# Altium schematic sheet [CC2538] MCU.SchDoc
size 254 x 208 mm
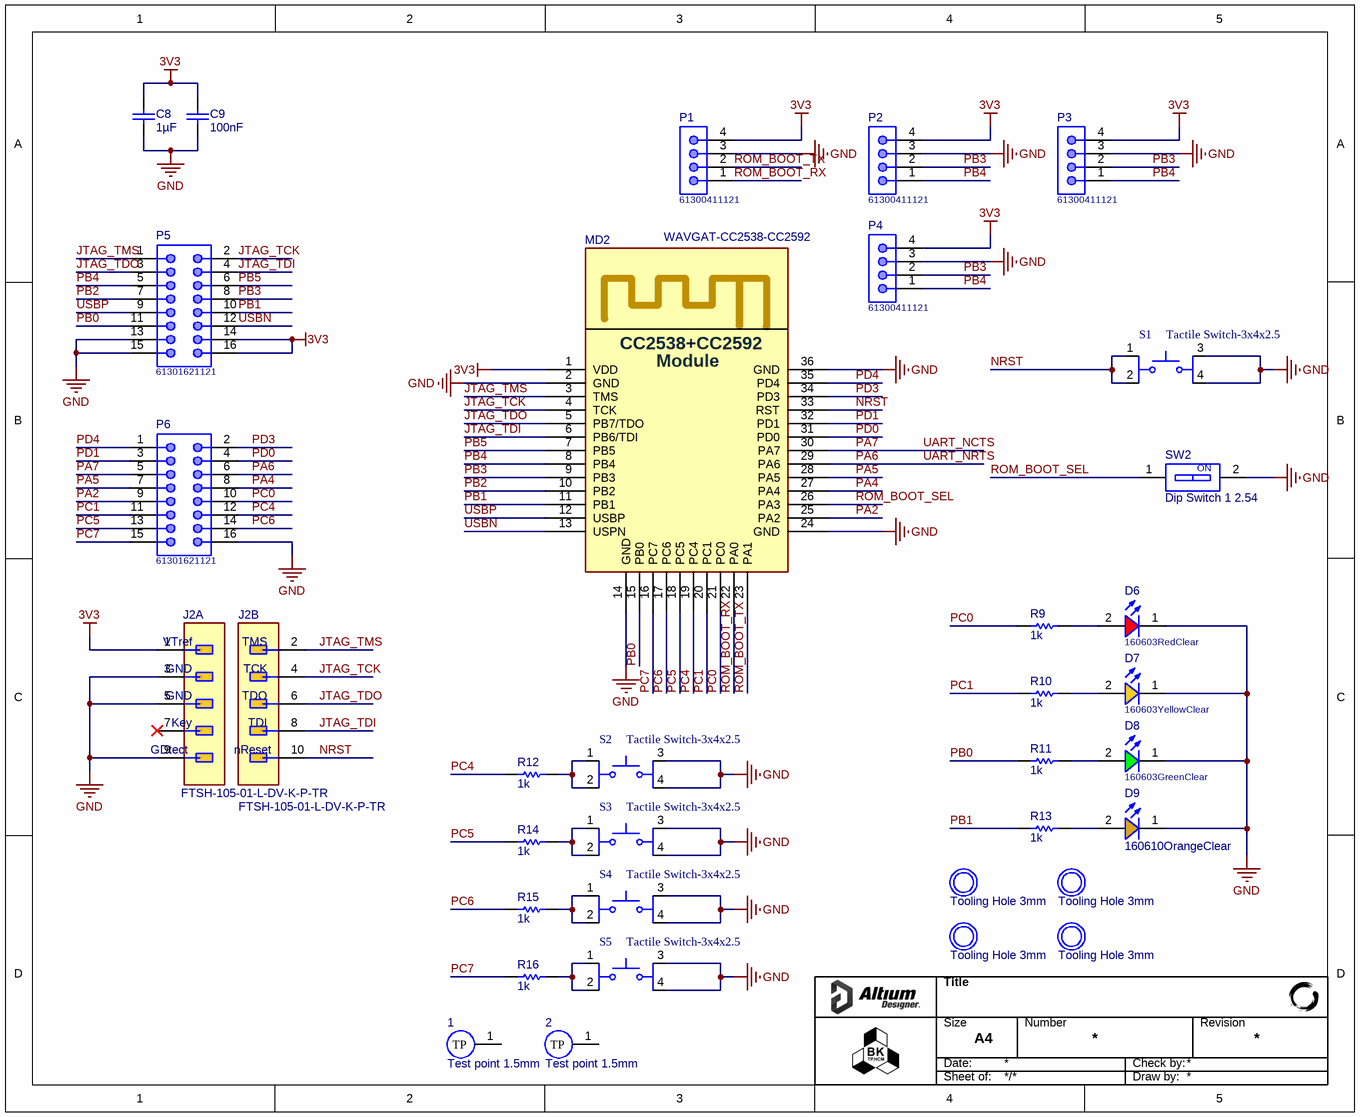
[diagram p0: [CC2538] MCU.SchDoc]

## Parts
1  Test point 1.5mm  [Test point 1.5mm-Footprint-1]
2  Test point 1.5mm  [Test point 1.5mm-Footprint-1]
C8  value 1µF  [CAP_0603]  (hidden comment: 0106031051016)
C9  value 100nF  [CAP_0603]  (hidden comment: 0106031041050)
D6  160603RedClear  [WL-SMCW_0603_H=0.7mm]
D7  160603YellowClear  [WL-SMCW_0603_H=0.7mm]
D8  160603GreenClear  [WL-SMCW_0603_H=0.7mm]
D9  160610OrangeClear  [WL-SMCW_0603_H=0.7mm]
H1  Tooling Hole 3mm  [3mm]  (no BOM)
H2  Tooling Hole 3mm  [3mm]  (no BOM)
H3  Tooling Hole 3mm  [3mm]  (no BOM)
H4  Tooling Hole 3mm  [3mm]  (no BOM)
J2  FTSH-105-01-L-DV-K-P-TR  [FP-FTSH-105-01-L-DV-K-P-T-MFG]  (parts A,B of 2)
MD2  WAVGAT-CC2538-CC2592  [WAVGAT-CC2538-CC2592-Footprint]
P1  61300411121  [61300411121]
P2  61300411121  [61300411121]
P3  61300411121  [61300411121]
P4  61300411121  [61300411121]
P5  61301621121  [61301621121]
P6  61301621121  [61301621121]
R9  value 1k  [RES_0603]  (hidden comment: 0006031021)
R10  value 1k  [RES_0603]  (hidden comment: 0006031021)
R11  value 1k  [RES_0603]  (hidden comment: 0006031021)
R12  value 1k  [RES_0603]  (hidden comment: 0006031025)
R13  value 1k  [RES_0603]  (hidden comment: 0006031021)
R14  value 1k  [RES_0603]  (hidden comment: 0006031025)
R15  value 1k  [RES_0603]  (hidden comment: 0006031025)
R16  value 1k  [RES_0603]  (hidden comment: 0006031025)
S1  Tactile Switch-3x4x2.5  [Tactile Switch-3x4x2.5 Footprint]
S2  Tactile Switch-3x4x2.5  [Tactile Switch-3x4x2.5 Footprint]
S3  Tactile Switch-3x4x2.5  [Tactile Switch-3x4x2.5 Footprint]
S4  Tactile Switch-3x4x2.5  [Tactile Switch-3x4x2.5 Footprint]
S5  Tactile Switch-3x4x2.5  [Tactile Switch-3x4x2.5 Footprint]
SW2  Dip Switch 1 2.54  [Dip Switch 1 2.54-Footprint-1]

## Nets
3V3: C8.2 C9.2 J2.1(VTref) MD2.1(VDD) P1.4 P2.4 P3.4 P4.4 P5.14 P5.16
GND: C8.1 C9.1 D6.1(K) D7.1(K) D8.1(K) D9.1(K) J2.3 J2.5 J2.9 MD2.2(GND) MD2.14(GND) MD2.24(GND) MD2.36(GND) P1.3 P2.3 P3.3 P4.3 P5.13 P5.15 P6.16 S1.3 S1.4 S2.3 S2.4 S3.3 S3.4 S4.3 S4.4 S5.3 S5.4 SW2.2
JTAG_TCK: J2.4 MD2.4(TCK) P5.2
JTAG_TDI: J2.8 MD2.6(PB6/TDI) P5.4
JTAG_TDO: J2.6 MD2.5(PB7/TDO) P5.3
JTAG_TMS: J2.2(VTref) MD2.3(TMS) P5.1
NRST: J2.10 MD2.33(RST) S1.1 S1.2
PA2: MD2.25(PA2) P6.9
PA4: MD2.27(PA4) P6.8
PA5: MD2.28(PA5) P6.7
PA6: MD2.29(PA6) P6.6  [also labelled UART_NRTS]
PA7: MD2.30(PA7) P6.5  [also labelled UART_NCTS]
PB0: MD2.15(PB0) P5.11 R11.1
PB1: MD2.11(PB1) P5.10 R13.1
PB2: MD2.10(PB2) P5.7
PB3: MD2.9(PB3) P2.2 P3.2 P4.2 P5.8
PB4: MD2.8(PB4) P2.1 P3.1 P4.1 P5.5
PB5: MD2.7(PB5) P5.6
PC0: MD2.21(PC0) P6.10 R9.1
PC1: MD2.20(PC1) P6.11 R10.1
PC4: MD2.19(PC4) P6.12 R12.1
PC5: MD2.18(PC5) P6.13 R14.1
PC6: MD2.17(PC6) P6.14 R15.1
PC7: MD2.16(PC7) P6.15 R16.1
PD0: MD2.31(PD0) P6.4
PD1: MD2.32(PD1) P6.3
PD3: MD2.34(PD3) P6.2
PD4: MD2.35(PD4) P6.1
ROM_BOOT_RX: MD2.22(PA0) P1.1
ROM_BOOT_SEL: MD2.26(PA3) SW2.1
ROM_BOOT_TX: MD2.23(PA1) P1.2
USBN: MD2.13(USPN) P5.12
USBP: MD2.12(USBP) P5.9
NetD6_2: D6.2(A) R9.2
NetD7_2: D7.2(A) R10.2
NetD8_2: D8.2(A) R11.2
NetD9_2: D9.2(A) R13.2
NetR12_2: R12.2 S2.1 S2.2
NetR14_2: R14.2 S3.1 S3.2
NetR15_2: R15.2 S4.1 S4.2
NetR16_2: R16.2 S5.1 S5.2

Not connected (* = marked no-connect by the designer): 1 1(TP); 2 1(TP); J2 7*

## Notes on the sheet
- Title
- Size
- Date:
- A4
- Number
- Check by:
- Revision
- Sheet of:
- Draw by:
- (in symbol CMP-002-00347-1, part A) GND; Key; GDtect
- (in symbol CMP-002-00347-1, part B) TMS; TCK; TDO; TDI; nReset
- (in symbol CMP-011-00016-1) ON
- (in symbol CMP-021-00009-2) CC2538+CC2592; Module

## Library data of the parts
1 2 = CMP-00028-00008-2: Test point, 1.5mm radius
C8 = CMP-001-00177-2: CAP, size 0603, 1 uF, 16 VDC, 10%; Manufacturer Part Number: CL10B105KO8NNWC; Manufacturer: Samsung Electro-Mechanics; Voltage Rating DC: 16 VDC; Component Type: Standard; Supplier 3 URL: https://www.thegioiic.com/tu-gom-0603-1uf-16v; Operating Temperature Max: + 85 C; Tolerance: 10%; Supplier 3 Part Number: N/A; Source: Capacitor_0603_10_percent.SchLib; Case/Package: 0603; Supplier 1 Part Number: 187-CL10B105KO8NNWC; Operating Temperature Min: - 40 C; Packaging: Tape and Reel; Design Item ID: 0106031051016; LCSC Part #: C1592; Supplier 2 Part Number: 1276-CL10B105KO8NNWCTR-ND; Supplier 2 URL: https://www.digikey.com/en/products/detail/samsung-electro-mechanics/cl10b105ko8nnwc/16572783; Supplier 1 URL: https://www.mouser.vn/ProductDetail/Samsung-Electro-Mechanics/CL10B105KO8NNWC?qs=81r%252BiQLm7BT%252BXtc72qn1ug%3D%3D&utm_source=mouser-refine-download&utm_medium=file&utm_campaign=CL10B105KO8NNWC&utm_content=Samsung-Electro-Mechanics; ComponentLink1URL: https://www.mouser.vn/datasheet/2/585/Samsung_MLCC_1837944-1929650.pdf; Pins: 2; Mount: SMD/SMT; ComponentLink1Description: Datasheet
C9 = CMP-001-00176-2: CAP, size 0603, 100 nF, 50 VDC, 10%; Manufacturer Part Number: CGA3E3X8R1H104K080AE; Manufacturer: TDK; Voltage Rating DC: 50 VDC; Source: Capacitor_0603_10_percent.SchLib; Operating Temperature Min: - 40 C; Supplier 3 URL: https://www.thegioiic.com/tu-gom-0603-100nf-0-1uf-50v; Supplier 1 Part Number: 810-CGA3E3X8R1H104KA; Mount: SMD/SMT; Supplier 1 URL: https://www.mouser.com/ProductDetail/TDK/CGA3E3X8R1H104K080AE?qs=nQSIdc08i%252Bd8g3IRRgU2bw%3D%3D&utm_source=mouser-refine-download&utm_medium=file&utm_campaign=CGA3E3X8R1H104K080AE&utm_content=TDK; Packaging: Tape and Reel; Supplier 3 Part Number: N/A; LCSC Part #: C14663; ComponentLink1Description: Datasheet; Operating Temperature Max: + 85 C; Design Item ID: 0106031041050; Supplier 2 URL: https://www.digikey.com/en/products/detail/tdk-corporation/cga3e3x8r1h104k080ae/5809262; Component Type: Standard; Supplier 2 Part Number: 445-173697-2-ND; Case/Package: 0603; Tolerance: 10%; ComponentLink1URL: https://product.tdk.com/system/files/dam/doc/product/capacitor/ceramic/mlcc/catalog/mlcc_automotive_soft_en.pdf?ref_disty=mouser; Pins: 2
D6 = CMP-004-00038-2: WL-SMCW SMT Mono-color Chip LED Waterclear, size 0603, Red, 2V, 140deg; Value: Red, 2V; Type: Clear; ComponentLink1Description: Datasheet link; ComponentLink2Description: Supplier 1 URL; Supplier 3 SN: N/A; Design Item ID: 160603RedClear; Source: WL-SMCW_0603.SchLib; Supplier 3 Name: ICDayRoi; Size: 0603; Supplier 1 SN: 710-150060RS75000; Pins: 2; ComponentLink4Description: Supplier 3 URL; Component Type: Standard; ComponentLink2URL: https://www.mouser.vn/ProductDetail/Wurth-Elektronik/150060RS75000?qs=LlUlMxKIyB3QnmZ3fw%2FVCA%3D%3D; Color: Red; ComponentLink3Description: Supplier 2 URL; Supplier 3 URL: https://www.thegioiic.com/led-do-0603-dan-smd-trong-suot; Supplier 2 URL: https://www.digikey.com/en/products/detail/liteon/LTST-C191KRKT/386837; ComponentLink1URL: N/A; ComponentLink3URL: https://www.digikey.com/en/products/detail/liteon/LTST-C191KRKT/386837; ComponentLink4URL: https://www.thegioiic.com/led-do-0603-dan-smd-trong-suot; Supplier 2 Name: Digi-Key; Supplier 1 Name: Mouser; Supplier 1 URL: https://www.mouser.vn/ProductDetail/Wurth-Elektronik/150060RS75000?qs=LlUlMxKIyB3QnmZ3fw%2FVCA%3D%3D; Supplier 2 SN: 160-1447-2-ND
D7 = CMP-004-00042-2: WL-SMCW SMT Mono-color Chip LED Waterclear, size 0603, Yellow, 2V, 140deg; Type: Clear; ComponentLink1Description: Datasheet link; ComponentLink3Description: Supplier 2 URL; Supplier 1 URL: https://www.mouser.com/ProductDetail/Wurth-Elektronik/150060YS75003?qs=Li%252BoUPsLEnvfob7qsAi9dA%3D%3D; Supplier 3 Name: ICDayRoi; Supplier 3 SN: N/A; ComponentLink2URL: https://www.mouser.com/ProductDetail/Wurth-Elektronik/150060YS75003?qs=Li%252BoUPsLEnvfob7qsAi9dA%3D%3D; ComponentLink4Description: Supplier 3 URL; Supplier 3 URL: https://icdayroi.com/led-yellow-0603; ComponentLink1URL: N/A; Source: WL-SMCW_0603.SchLib; Color: Yellow; Design Item ID: 160603YellowClear; Component Type: Standard; Size: 0603; ComponentLink4URL: https://icdayroi.com/led-yellow-0603; ComponentLink2Description: Supplier 1 URL; Supplier 1 Name: Mouser; Supplier 1 SN: 710-150060YS75003; ComponentLink3URL: https://www.digikey.com/en/products/detail/liteon/LTST-C191KSKT/386839; Supplier 2 URL: https://www.digikey.com/en/products/detail/liteon/LTST-C191KSKT/386839; Supplier 2 Name: Digi-Key; Value: Yellow, 2V; Supplier 2 SN: 160-1448-2-ND; Pins: 2
D8 = CMP-004-00034-2: WL-SMCW SMT Mono-color Chip LED Waterclear, size 0603, Green, 3.2V, 140deg; Type: Clear; Size: 0603; Supplier 3 SN: N/A; Supplier 3 URL: https://www.thegioiic.com/led-xanh-la-0603-dan-smd-trong-suot; ComponentLink4Description: Supplier 3 URL; ComponentLink3URL: https://www.digikey.com/en/products/detail/liteon/LTST-C191KGKT/386835; Pins: 2; Supplier 1 SN: 710-150060GS75000; Source: WL-SMCW_0603.SchLib; Supplier 1 Name: Mouser; ComponentLink2URL: https://www.mouser.vn/ProductDetail/Wurth-Elektronik/150060GS75000?qs=LlUlMxKIyB0UYkq5lDO8nA%3D%3D; ComponentLink1URL: N/A; Component Type: Standard; ComponentLink3Description: Supplier 2 URL; Supplier 2 SN: 160-1446-2-ND; Value: Green, 3.2V; Design Item ID: 160603GreenClear; ComponentLink2Description: Supplier 1 URL; Supplier 2 URL: https://www.digikey.com/en/products/detail/liteon/LTST-C191KGKT/386835; ComponentLink4URL: https://www.thegioiic.com/led-xanh-la-0603-dan-smd-trong-suot; ComponentLink1Description: Datasheet link; Supplier 3 Name: ICDayRoi; Supplier 1 URL: https://www.mouser.vn/ProductDetail/Wurth-Elektronik/150060GS75000?qs=LlUlMxKIyB0UYkq5lDO8nA%3D%3D; Supplier 2 Name: Digi-Key; Color: Green
D9 = CMP-007-00036-1: Colour: Orange
H1-H4 = CMP-034-000004-2: Source: Hole.SchLib; Design Item ID: Tooling Hole 3mm; Pin Count: 0; Component Type: Standard (No BOM)
J2 = CMP-002-00347-1: JTAG Connector - Board Connector, 10 Contact(s), 2 Row(s), Male, Straight, 0.05 inch Pitch, Surface Mount Terminal, Locking; RoHS Compliant: Yes; Mounting Technology: Board; Connector Type: BOARD CONNECTOR
MD2 = CMP-021-00009-2: WAVGAT-CC2538-CC2592 Module
P1-P4 = CMP-002-01000-1: WR-PHD Pin Header, THT, pitch 2.54mm, Single Row, Vertical, 4p; Manufacturer: Wurth Elektronik; Contact Resistance: 20mOhm; Value: 3A, 250 V (AC); Withstanding Voltage: 500VAC; Rated Current: 3A; Working Voltage: 250VAC; Pin Number: 4; Supplier 1 URL: https://www.mouser.vn/ProductDetail/Wurth-Elektronik/61300311121?qs=PhR8RmCirEYxRWFJzNKsUw%3D%3D; Pins: 4; Supplier 3 Part Number: N/A; LCSC Part #: N/A; ComponentLink1URL: https://www.we-online.com/catalog/datasheet/61300411121.pdf; Pitch: 2.54mm; Supplier 2 URL: N/A; Packaging: Bag; Gender: Pin Header; Operating Temperature Min: - 25 C; Operating Temperature Max: + 85 C; Source: WR-PHD_Pin Header_2.54mm.SchLib; Orientation: Vertical; Mount: THT; Row Number: Single; Supplier 2 Part Number: N/A; Design Item ID: 61300411121; Published Date: May 2020; Supplier 3 URL: N/A; Component Type: Standard; Supplier 1 Part Number: 710-61300311121; ComponentLink1Description: Datasheet; Manufacturer Part Number: 61300411121
P5 P6 = CMP-002-01084-1: WR-PHD Pin Header, THT, pitch 2.54mm, Dual Row, Vertical, 16p; Manufacturer: Wurth Elektronik; Rated Current: 3A; Working Voltage: 250VAC; Contact Resistance: 20mOhm; Withstanding Voltage: 500VAC; Value: 3A, 250 V (AC); Pin Number: 16; Supplier 2 URL: N/A; Gender: Pin Header; LCSC Part #: N/A; Supplier 1 Part Number: 710-61301621121; Source: WR-PHD_Pin Header_2.54mm.SchLib; Manufacturer Part Number: 61301621121; Operating Temperature Min: - 25 C; Supplier 3 URL: https://www.thegioiic.com/hang-rao-duc-doi-2-54mm-16-chan-2-hang-cao-11-2mm-xuyen-lo; Supplier 2 Part Number: N/A; Published Date: May 2020; Pitch: 2.54mm; ComponentLink1Description: Datasheet; Row Number: Dual; Operating Temperature Max: + 85 C; Orientation: Vertical; Mount: THT; Supplier 3 Part Number: N/A; Packaging: Bag; Supplier 1 URL: https://www.mouser.vn/ProductDetail/Wurth-Elektronik/61301621121?qs=PhR8RmCirEZBHI%2Fm2diuGA%3D%3D; Pins: 16; Design Item ID: 61301621121; Component Type: Standard; ComponentLink1URL: https://www.we-online.com/catalog/datasheet/61301621121.pdf
R9-R11 R13 = CMP-009-00185-4: RES, size 0603, 1 KOhm, 1/10 W, 1%; Manufacturer Part Number: RC0603FR-071KL; Manufacturer: YAGEO; Rated Power: 1/10 W; Tolerance: 1%; Supplier 1 URL: https://www.mouser.vn/ProductDetail/YAGEO/RC0603FR-071KL?qs=VU8sRB4EgwApHsk4rF%2F3zg%3D%3D; ComponentLink1URL: https://www.yageo.com/upload/media/product/productsearch/datasheet/rchip/PYu-SR_20105_RoHS_L_10.pdf; Supplier 3 URL: N/A; Case/Package: 0603; Supplier 2 URL: https://www.digikey.com/en/products/detail/yageo/rc0603fr-071kl/726843; Mount: SMD/SMT; Supplier 2 Part Number: 311-1.00KHRTR-ND; Source: Resistor_0603.SchLib; Packaging: Tape and Reel; Component Type: Standard; Design Item ID: 0006031021; ComponentLink1Description: Datasheet; Operating Temperature Max: + 85 C; Supplier 3 Part Number: N/A; Operating Temperature Min: - 40 C; LCSC Part #: C22548; Supplier 1 Part Number: 603-RC0603FR-071KL; Pins: 2
R12 R14-R16 = CMP-009-00186-4: RES, size 0603, 1 KOhm, 1/10 W, 5%; Manufacturer Part Number: ERJ-UP3J102V; Manufacturer: Panasonic; Rated Power: 1/10 W; Supplier 3 URL: N/A; Tolerance: 5%; Mount: SMD/SMT; ComponentLink1URL: https://www.mouser.vn/datasheet/2/315/Panasonic_Resistors_Thick_Film_Anti_Sulf_Anti_Surg-1825099.pdf; ComponentLink1Description: Datasheet; Operating Temperature Max: + 85 C; Supplier 2 URL: https://www.mouser.vn/ProductDetail/Panasonic/ERJ-UP3J102V?qs=GedFDFLaBXG0ASpYP%252B3phQ%3D%3D; Supplier 1 Part Number: 667-ERJ-UP3J102V; Packaging: Tape and Reel; Supplier 3 Part Number: N/A; Component Type: Standard; Supplier 1 URL: https://www.mouser.vn/ProductDetail/Panasonic/ERJ-UP3J102V?qs=GedFDFLaBXG0ASpYP%252B3phQ%3D%3D; Case/Package: 0603; Pins: 2; Operating Temperature Min: - 40 C; Supplier 2 Part Number: 667-ERJ-UP3J102V; Source: Resistor_0603.SchLib; Design Item ID: 0006031025; LCSC Part #: N/A
S1-S5 = CMP-011-00013-5: Tactile Switch, 3x4x2.5mm; Mounting Technology: SMT; Pins: 4
SW2 = CMP-011-00016-1: Slide Dip Switch, 1 Switches, SPST, Latched, 0.025A, 24VDC, 0 PCB Hole Cnt, Solder Terminal, Surface Mount-straight